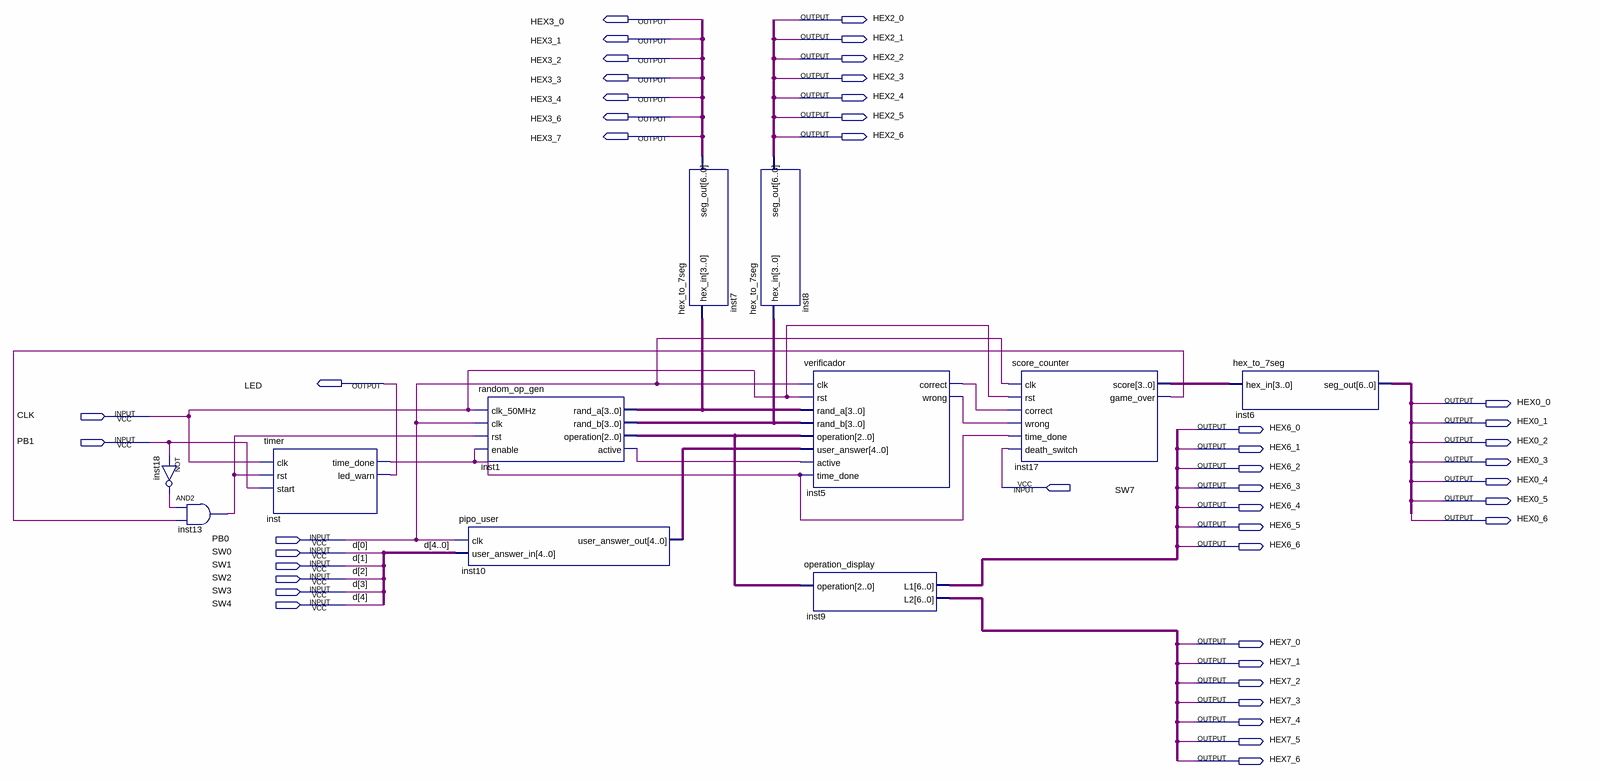
[diagram p0: schematic sheet]
// Quartus schematic proj_final.bdf as structural Verilog: 11 symbols, 45 pins
module proj_final (
  input  CLK,
  input  PB1,
  input  SW7,
  input  PB0,
  input  SW0,
  input  SW1,
  input  SW2,
  input  SW3,
  input  SW4,
  output HEX3_0,
  output HEX2_0,
  output HEX3_1,
  output HEX2_1,
  output HEX3_2,
  output HEX2_2,
  output HEX3_3,
  output HEX2_3,
  output HEX3_4,
  output HEX2_4,
  output HEX3_6,
  output HEX2_5,
  output HEX3_7,
  output HEX2_6,
  output LED,
  output HEX0_0,
  output HEX0_1,
  output HEX6_0,
  output HEX0_2,
  output HEX6_1,
  output HEX0_3,
  output HEX6_2,
  output HEX0_4,
  output HEX6_3,
  output HEX0_5,
  output HEX6_4,
  output HEX0_6,
  output HEX6_5,
  output HEX6_6,
  output HEX7_0,
  output HEX7_1,
  output HEX7_2,
  output HEX7_3,
  output HEX7_4,
  output HEX7_5,
  output HEX7_6
);

  wire inst1_active, inst5_correct, inst5_wrong, inst13_out, inst17_game_over, inst18_out, inst_time_done;
  wire [2:0] inst1_operation;
  wire [3:0] inst1_rand_a, inst1_rand_b, inst17_score;
  wire [4:0] inst10_user_answer_out;
  wire [6:0] inst6_seg_out, inst7_seg_out, inst8_seg_out, inst9_l1, inst9_l2;

  not inst18 (inst18_out, PB1);
  and inst13 (inst13_out, inst18_out, inst17_game_over);
  timer inst (.clk(CLK), .rst(inst13_out), .start(PB1), .time_done(inst_time_done), .led_warn(LED));
  random_op_gen inst1 (
    .clk_50MHz(CLK), .clk(PB0), .rst(inst13_out), .enable(inst_time_done), .rand_a(inst1_rand_a),
    .rand_b(inst1_rand_b), .operation(inst1_operation), .active(inst1_active));
  pipo_user inst10 (.clk(PB0), .user_answer_in({SW4, SW3, SW2, SW1, SW0}), .user_answer_out(inst10_user_answer_out));
  hex_to_7seg inst7 (.hex_in(inst1_rand_a), .seg_out(inst7_seg_out));
  hex_to_7seg inst8 (.hex_in(inst1_rand_b), .seg_out(inst8_seg_out));
  verificador inst5 (
    .clk(PB0), .rst(CLK), .rand_a(inst1_rand_a), .rand_b(inst1_rand_b), .operation(inst1_operation),
    .user_answer(inst10_user_answer_out), .active(inst1_active), .time_done(inst_time_done),
    .correct(inst5_correct), .wrong(inst5_wrong));
  operation_display inst9 (.operation(inst1_operation), .L1(inst9_l1), .L2(inst9_l2));
  score_counter inst17 (
    .clk(PB0), .rst(CLK), .correct(inst5_correct), .wrong(inst5_wrong), .time_done(inst_time_done),
    .death_switch(SW7), .score(inst17_score), .game_over(inst17_game_over));
  hex_to_7seg inst6 (.hex_in(inst17_score), .seg_out(inst6_seg_out));

  // Other names for the same wires on the sheet: d[4:0] = {SW4, SW3, SW2, SW1, SW0}
endmodule
